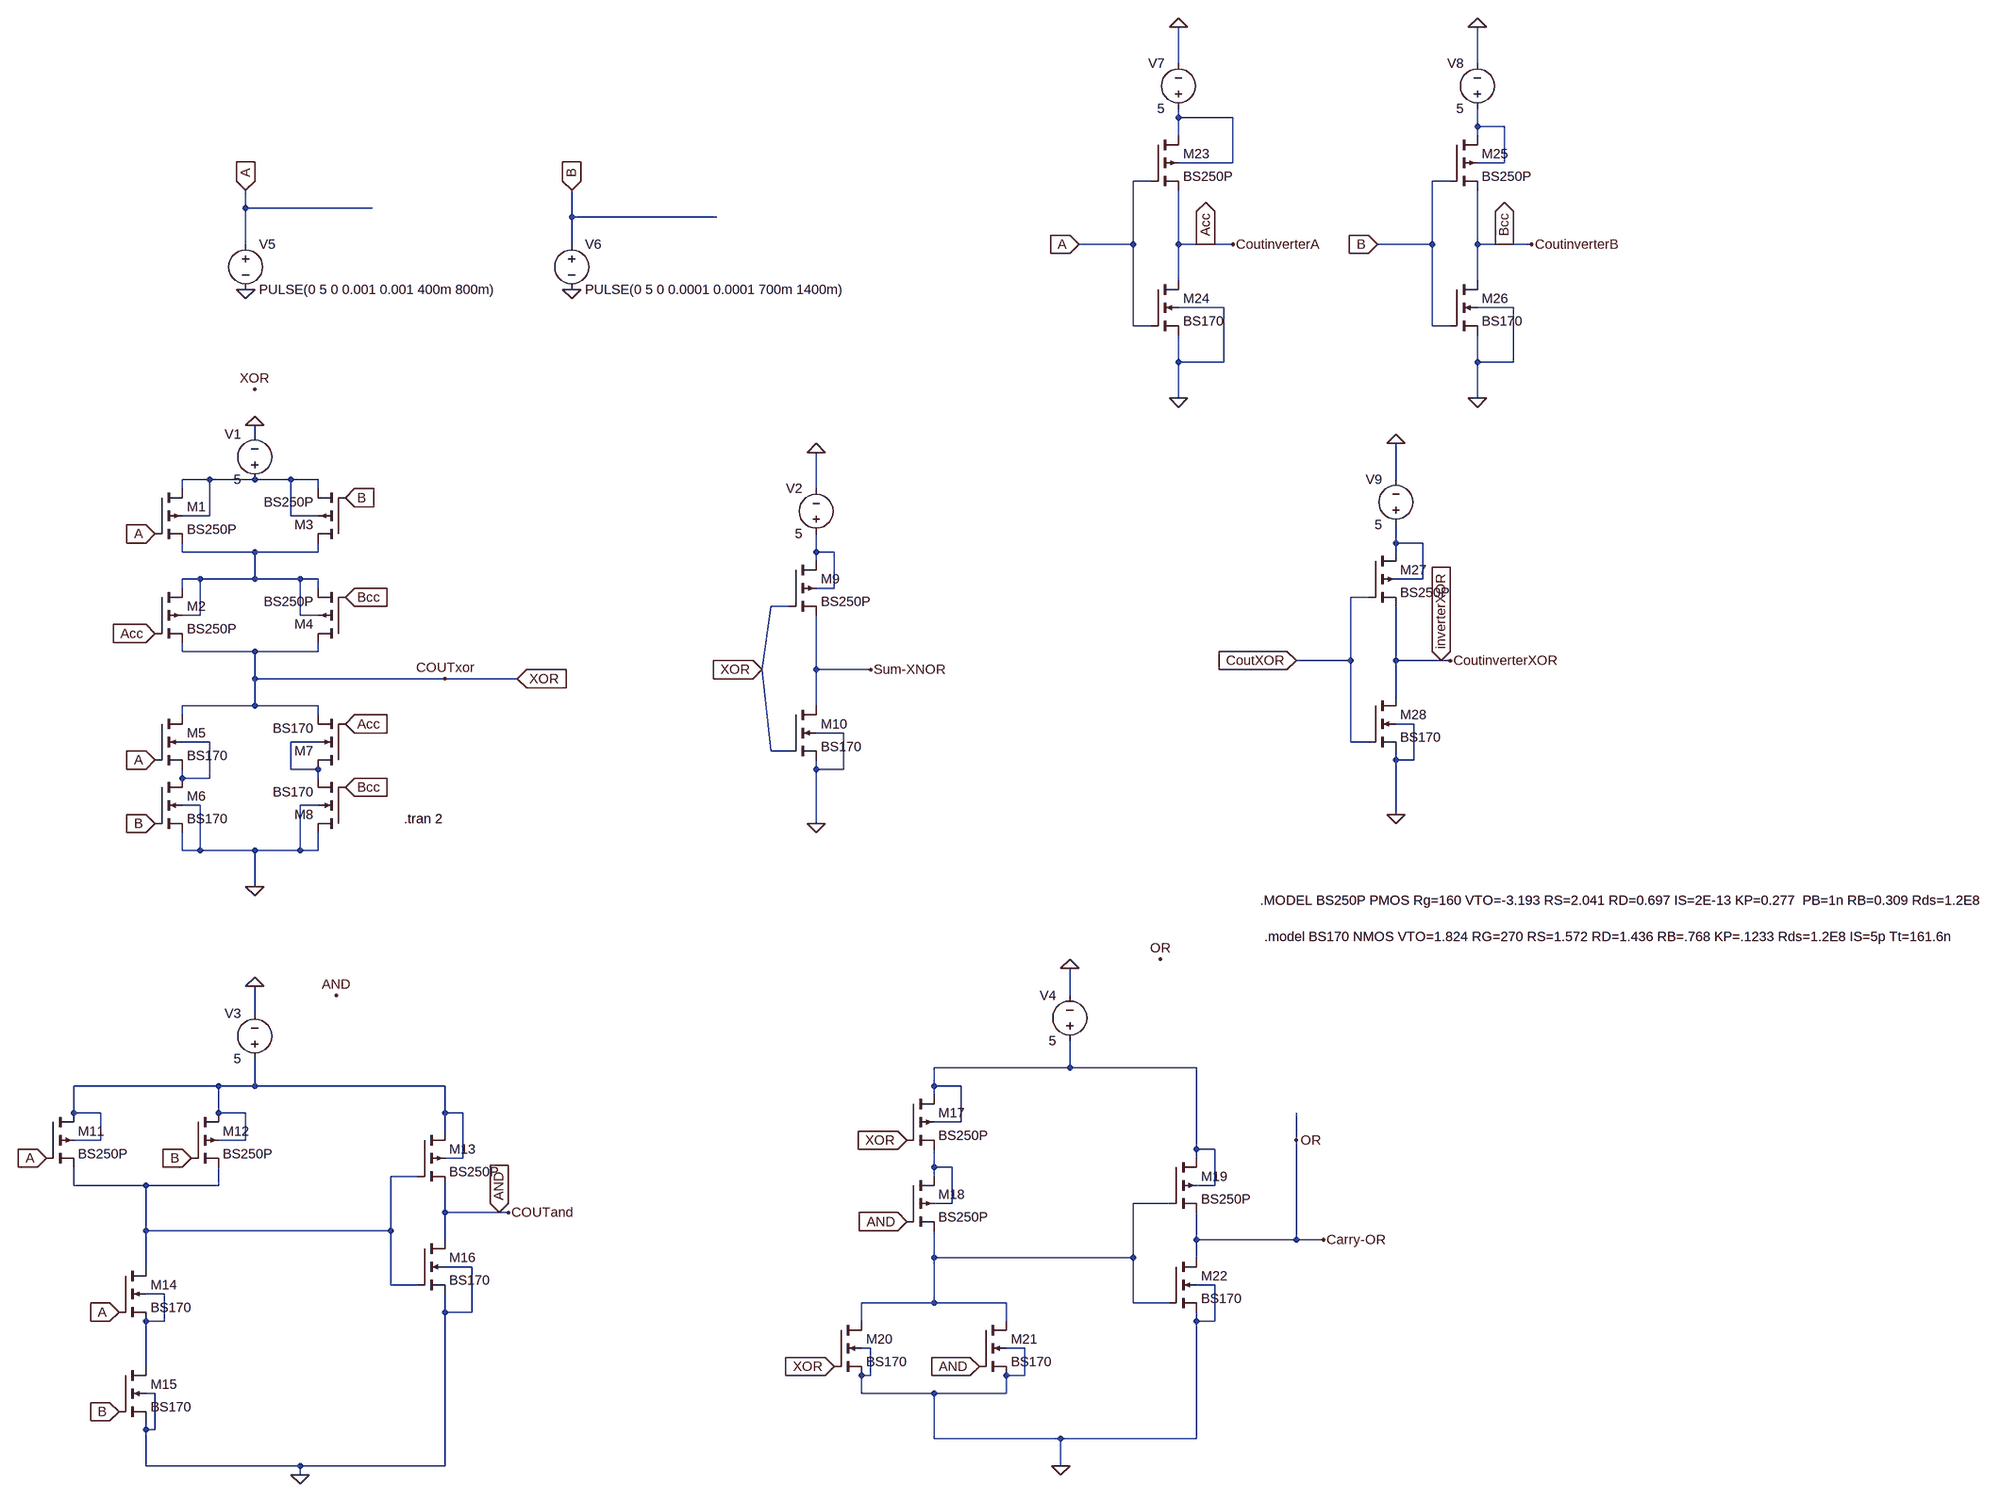
[diagram p0: schematic FULL_CIRCUIT_LAST.asc]
FULL_CIRCUIT_LAST.asc, the LTspice schematic file:
Version 4
SHEET 1 4512 1652
WIRE 1680 -864 1680 -928
WIRE 2208 -864 2208 -928
WIRE 1680 -768 1680 -784
WIRE 1776 -768 1680 -768
WIRE 2208 -752 2208 -784
WIRE 2256 -752 2208 -752
WIRE 1680 -736 1680 -768
WIRE 2208 -736 2208 -752
WIRE 1776 -688 1776 -768
WIRE 1776 -688 1680 -688
WIRE 2256 -688 2256 -752
WIRE 2256 -688 2208 -688
WIRE 1632 -656 1600 -656
WIRE 2160 -656 2128 -656
WIRE 32 -608 32 -640
WIRE 256 -608 32 -608
WIRE 608 -592 608 -640
WIRE 864 -592 608 -592
WIRE 32 -544 32 -608
WIRE 608 -544 608 -592
WIRE 1600 -544 1600 -656
WIRE 1600 -544 1504 -544
WIRE 1680 -544 1680 -640
WIRE 1728 -544 1680 -544
WIRE 1776 -544 1728 -544
WIRE 2128 -544 2128 -656
WIRE 2128 -544 2032 -544
WIRE 2208 -544 2208 -640
WIRE 2256 -544 2208 -544
WIRE 2304 -544 2256 -544
WIRE 1680 -480 1680 -544
WIRE 2208 -480 2208 -544
WIRE 1760 -432 1680 -432
WIRE 2272 -432 2208 -432
WIRE 1600 -400 1600 -544
WIRE 1632 -400 1600 -400
WIRE 2128 -400 2128 -544
WIRE 2160 -400 2128 -400
WIRE 1680 -336 1680 -384
WIRE 1760 -336 1760 -432
WIRE 1760 -336 1680 -336
WIRE 2208 -336 2208 -384
WIRE 2272 -336 2272 -432
WIRE 2272 -336 2208 -336
WIRE 1680 -272 1680 -336
WIRE 2208 -272 2208 -336
WIRE 48 -208 48 -224
WIRE -32 -128 -80 -128
WIRE 48 -128 -32 -128
WIRE 112 -128 48 -128
WIRE 160 -128 112 -128
WIRE 2064 -128 2064 -192
WIRE -80 -112 -80 -128
WIRE 160 -112 160 -128
WIRE 1040 -112 1040 -176
WIRE -32 -64 -32 -128
WIRE -32 -64 -80 -64
WIRE 112 -64 112 -128
WIRE 160 -64 112 -64
WIRE 2064 -16 2064 -48
WIRE 2112 -16 2064 -16
WIRE -80 0 -80 -16
WIRE 48 0 -80 0
WIRE 160 0 160 -16
WIRE 160 0 48 0
WIRE 1040 0 1040 -32
WIRE 1072 0 1040 0
WIRE 2064 0 2064 -16
WIRE 1040 16 1040 0
WIRE -48 48 -80 48
WIRE 48 48 48 0
WIRE 48 48 -48 48
WIRE 128 48 48 48
WIRE 160 48 128 48
WIRE 2112 48 2112 -16
WIRE 2112 48 2064 48
WIRE -80 64 -80 48
WIRE 160 64 160 48
WIRE 1072 64 1072 0
WIRE 1072 64 1040 64
WIRE 2016 80 1984 80
WIRE 992 96 960 96
WIRE -48 112 -48 48
WIRE -48 112 -80 112
WIRE 128 112 128 48
WIRE 160 112 128 112
WIRE -80 176 -80 160
WIRE 48 176 -80 176
WIRE 160 176 160 160
WIRE 160 176 48 176
WIRE 1984 192 1984 80
WIRE 1984 192 1888 192
WIRE 2064 192 2064 96
WIRE 2144 192 2064 192
WIRE 2160 192 2144 192
WIRE 944 208 960 96
WIRE 1040 208 1040 112
WIRE 1136 208 1040 208
WIRE 48 224 48 176
WIRE 384 224 48 224
WIRE 512 224 384 224
WIRE 2064 256 2064 192
WIRE 48 272 48 224
WIRE 48 272 -80 272
WIRE 160 272 48 272
WIRE 1040 272 1040 208
WIRE -80 288 -80 272
WIRE 160 288 160 272
WIRE 2096 304 2064 304
WIRE 1088 320 1040 320
WIRE -32 336 -80 336
WIRE 160 336 112 336
WIRE 1984 336 1984 192
WIRE 2016 336 1984 336
WIRE 960 352 944 208
WIRE 992 352 960 352
WIRE 2064 368 2064 352
WIRE 2096 368 2096 304
WIRE 2096 368 2064 368
WIRE 112 384 112 336
WIRE 160 384 112 384
WIRE 1040 384 1040 368
WIRE 1088 384 1088 320
WIRE 1088 384 1040 384
WIRE -80 400 -80 384
WIRE -32 400 -32 336
WIRE -32 400 -80 400
WIRE 160 400 160 384
WIRE -48 448 -80 448
WIRE 160 448 128 448
WIRE 2064 464 2064 368
WIRE 1040 480 1040 384
WIRE -80 528 -80 496
WIRE -48 528 -48 448
WIRE -48 528 -80 528
WIRE 48 528 -48 528
WIRE 128 528 128 448
WIRE 128 528 48 528
WIRE 160 528 160 496
WIRE 160 528 128 528
WIRE 48 592 48 528
WIRE 1488 784 1488 736
WIRE 48 816 48 768
WIRE 1488 912 1488 864
WIRE 1488 912 1248 912
WIRE 1712 912 1488 912
WIRE -16 944 -272 944
WIRE 48 944 48 896
WIRE 48 944 -16 944
WIRE 384 944 48 944
WIRE 1248 944 1248 912
WIRE 1296 944 1248 944
WIRE 1248 960 1248 944
WIRE -272 992 -272 944
WIRE -224 992 -272 992
WIRE -16 992 -16 944
WIRE 32 992 -16 992
WIRE 384 992 384 944
WIRE 416 992 384 992
WIRE 1296 1008 1296 944
WIRE 1296 1008 1248 1008
WIRE 384 1024 384 992
WIRE -224 1040 -224 992
WIRE -224 1040 -272 1040
WIRE 32 1040 32 992
WIRE 32 1040 -16 1040
WIRE 1888 1040 1888 992
WIRE 1712 1056 1712 912
WIRE 1744 1056 1712 1056
WIRE 416 1072 416 992
WIRE 416 1072 384 1072
WIRE 1712 1072 1712 1056
WIRE 1248 1088 1248 1056
WIRE 1280 1088 1248 1088
WIRE 336 1104 288 1104
WIRE 1248 1104 1248 1088
WIRE -272 1120 -272 1088
WIRE -144 1120 -272 1120
WIRE -16 1120 -16 1088
WIRE -16 1120 -144 1120
WIRE 1744 1120 1744 1056
WIRE 1744 1120 1712 1120
WIRE 1280 1152 1280 1088
WIRE 1280 1152 1248 1152
WIRE 1664 1152 1600 1152
WIRE 384 1168 384 1120
WIRE 480 1168 384 1168
WIRE 496 1168 480 1168
WIRE -144 1200 -144 1120
WIRE 288 1200 288 1104
WIRE 288 1200 -144 1200
WIRE 384 1216 384 1168
WIRE 1712 1216 1712 1168
WIRE 1888 1216 1888 1040
WIRE 1888 1216 1712 1216
WIRE 1936 1216 1888 1216
WIRE 1248 1248 1248 1200
WIRE 1600 1248 1600 1152
WIRE 1600 1248 1248 1248
WIRE 1712 1248 1712 1216
WIRE -144 1264 -144 1200
WIRE 432 1264 384 1264
WIRE 288 1296 288 1200
WIRE 336 1296 288 1296
WIRE 1744 1296 1712 1296
WIRE -112 1312 -144 1312
WIRE 1248 1328 1248 1248
WIRE 1248 1328 1120 1328
WIRE 1376 1328 1248 1328
WIRE 1600 1328 1600 1248
WIRE 1664 1328 1600 1328
WIRE 384 1344 384 1312
WIRE 432 1344 432 1264
WIRE 432 1344 384 1344
WIRE -112 1360 -112 1312
WIRE -112 1360 -144 1360
WIRE 1120 1360 1120 1328
WIRE 1376 1360 1376 1328
WIRE 1712 1360 1712 1344
WIRE 1744 1360 1744 1296
WIRE 1744 1360 1712 1360
WIRE 1136 1408 1120 1408
WIRE 1408 1408 1376 1408
WIRE -144 1440 -144 1360
WIRE 1136 1456 1136 1408
WIRE 1136 1456 1120 1456
WIRE 1408 1456 1408 1408
WIRE 1408 1456 1376 1456
WIRE -128 1488 -144 1488
WIRE 1120 1488 1120 1456
WIRE 1248 1488 1120 1488
WIRE 1376 1488 1376 1456
WIRE 1376 1488 1248 1488
WIRE -144 1552 -144 1536
WIRE -128 1552 -128 1488
WIRE -128 1552 -144 1552
WIRE 1248 1568 1248 1488
WIRE 1472 1568 1248 1568
WIRE 1712 1568 1712 1360
WIRE 1712 1568 1472 1568
WIRE -144 1616 -144 1552
WIRE 128 1616 -144 1616
WIRE 384 1616 384 1344
WIRE 384 1616 128 1616
WIRE 1472 1616 1472 1568
WIRE 128 1632 128 1616
FLAG 1040 -176 0
FLAG 1040 480 0
FLAG 128 1632 0
FLAG -320 1072 A
IOPIN -320 1072 In
FLAG -192 1344 A
IOPIN -192 1344 In
FLAG -64 1072 B
IOPIN -64 1072 In
FLAG -192 1520 B
IOPIN -192 1520 In
FLAG 48 768 0
FLAG 496 1168 COUTand
FLAG 192 784 AND
FLAG 1472 1616 0
FLAG 1488 736 0
FLAG 1936 1216 Carry-OR
FLAG 1648 720 OR
FLAG 1136 208 Sum-XNOR
FLAG 32 -640 A
IOPIN 32 -640 In
FLAG 608 -640 B
IOPIN 608 -640 In
FLAG 32 -464 0
FLAG 608 -464 0
FLAG 1680 -928 0
FLAG 1680 -272 0
FLAG 1504 -544 A
IOPIN 1504 -544 In
FLAG 1776 -544 CoutinverterA
FLAG 2208 -928 0
FLAG 2208 -272 0
FLAG 2032 -544 B
IOPIN 2032 -544 In
FLAG 2304 -544 CoutinverterB
FLAG 1728 -544 Acc
IOPIN 1728 -544 Out
FLAG 2256 -544 Bcc
IOPIN 2256 -544 Out
FLAG -128 -32 A
IOPIN -128 -32 In
FLAG -128 368 A
IOPIN -128 368 In
FLAG 208 -96 B
IOPIN 208 -96 In
FLAG -128 480 B
IOPIN -128 480 In
FLAG -128 144 Acc
IOPIN -128 144 In
FLAG 208 304 Acc
IOPIN 208 304 In
FLAG 208 80 Bcc
IOPIN 208 80 In
FLAG 208 416 Bcc
IOPIN 208 416 In
FLAG 48 -224 0
FLAG 384 224 COUTxor
FLAG 48 -288 XOR
FLAG 48 592 0
FLAG 2064 -192 0
FLAG 2064 464 0
FLAG 2160 192 CoutinverterXOR
FLAG 512 224 XOR
IOPIN 512 224 In
FLAG 1888 192 CoutXOR
IOPIN 1888 192 In
FLAG 2144 192 inverterXOR
IOPIN 2144 192 In
FLAG 1200 1040 XOR
IOPIN 1200 1040 In
FLAG 1072 1440 XOR
IOPIN 1072 1440 In
FLAG 480 1168 AND
IOPIN 480 1168 In
FLAG 1200 1184 AND
IOPIN 1200 1184 In
FLAG 1328 1440 AND
IOPIN 1328 1440 In
FLAG 944 208 XOR
IOPIN 944 208 In
FLAG 1888 1040 OR
SYMBOL pmos4 992 16 R0
SYMATTR InstName M9
SYMATTR Value BS250P
SYMBOL nmos4 992 272 R0
SYMATTR InstName M10
SYMATTR Value BS170
SYMBOL voltage 1040 -16 R180
WINDOW 0 24 96 Left 2
WINDOW 3 24 16 Left 2
WINDOW 123 0 0 Left 2
WINDOW 39 0 0 Left 2
SYMATTR InstName V2
SYMATTR Value 5
SYMBOL pmos4 -320 992 R0
SYMATTR InstName M11
SYMATTR Value BS250P
SYMBOL pmos4 -64 992 R0
SYMATTR InstName M12
SYMATTR Value BS250P
SYMBOL pmos4 336 1024 R0
SYMATTR InstName M13
SYMATTR Value BS250P
SYMBOL voltage 48 912 R180
WINDOW 0 24 96 Left 2
WINDOW 3 24 16 Left 2
WINDOW 123 0 0 Left 2
WINDOW 39 0 0 Left 2
SYMATTR InstName V3
SYMATTR Value 5
SYMBOL voltage 1488 880 R180
WINDOW 0 24 96 Left 2
WINDOW 3 24 16 Left 2
WINDOW 123 0 0 Left 2
WINDOW 39 0 0 Left 2
SYMATTR InstName V4
SYMATTR Value 5
SYMBOL voltage 32 -560 R0
WINDOW 123 0 0 Left 2
WINDOW 39 0 0 Left 2
SYMATTR InstName V5
SYMATTR Value PULSE(0 5 0 0.001 0.001 400m 800m)
SYMBOL voltage 608 -560 R0
WINDOW 123 0 0 Left 2
WINDOW 39 0 0 Left 2
SYMATTR InstName V6
SYMATTR Value PULSE(0 5 0 0.0001 0.0001 700m 1400m)
SYMBOL pmos4 1632 -736 R0
SYMATTR InstName M23
SYMATTR Value BS250P
SYMBOL nmos4 1632 -480 R0
SYMATTR InstName M24
SYMATTR Value BS170
SYMBOL voltage 1680 -768 R180
WINDOW 0 24 96 Left 2
WINDOW 3 24 16 Left 2
WINDOW 123 0 0 Left 2
WINDOW 39 0 0 Left 2
SYMATTR InstName V7
SYMATTR Value 5
SYMBOL pmos4 2160 -736 R0
SYMATTR InstName M25
SYMATTR Value BS250P
SYMBOL nmos4 2160 -480 R0
SYMATTR InstName M26
SYMATTR Value BS170
SYMBOL voltage 2208 -768 R180
WINDOW 0 24 96 Left 2
WINDOW 3 24 16 Left 2
WINDOW 123 0 0 Left 2
WINDOW 39 0 0 Left 2
SYMATTR InstName V8
SYMATTR Value 5
SYMBOL pmos4 1200 960 R0
SYMATTR InstName M17
SYMATTR Value BS250P
SYMBOL pmos4 1200 1104 R0
SYMATTR InstName M18
SYMATTR Value BS250P
SYMBOL pmos4 1664 1072 R0
SYMATTR InstName M19
SYMATTR Value BS250P
SYMBOL nmos4 1072 1360 R0
SYMATTR InstName M20
SYMATTR Value BS170
SYMBOL nmos4 1328 1360 R0
SYMATTR InstName M21
SYMATTR Value BS170
SYMBOL nmos4 1664 1248 R0
SYMATTR InstName M22
SYMATTR Value BS170
SYMBOL voltage 48 -112 R180
WINDOW 0 24 96 Left 2
WINDOW 3 24 16 Left 2
WINDOW 123 0 0 Left 2
WINDOW 39 0 0 Left 2
SYMATTR InstName V1
SYMATTR Value 5
SYMBOL pmos4 -128 -112 R0
SYMATTR InstName M1
SYMATTR Value BS250P
SYMBOL pmos4 -128 64 R0
SYMATTR InstName M2
SYMATTR Value BS250P
SYMBOL pmos4 208 -16 R180
SYMATTR InstName M3
SYMATTR Value BS250P
SYMBOL pmos4 208 160 R180
SYMATTR InstName M4
SYMATTR Value BS250P
SYMBOL nmos4 -128 288 R0
SYMATTR InstName M5
SYMATTR Value BS170
SYMBOL nmos4 -128 400 R0
SYMATTR InstName M6
SYMATTR Value BS170
SYMBOL nmos4 208 384 R180
SYMATTR InstName M7
SYMATTR Value BS170
SYMBOL nmos4 208 496 R180
SYMATTR InstName M8
SYMATTR Value BS170
SYMBOL pmos4 2016 0 R0
SYMATTR InstName M27
SYMATTR Value BS250P
SYMBOL nmos4 2016 256 R0
SYMATTR InstName M28
SYMATTR Value BS170
SYMBOL voltage 2064 -32 R180
WINDOW 0 24 96 Left 2
WINDOW 3 24 16 Left 2
WINDOW 123 0 0 Left 2
WINDOW 39 0 0 Left 2
SYMATTR InstName V9
SYMATTR Value 5
SYMBOL nmos4 -192 1264 R0
SYMATTR InstName M14
SYMATTR Value BS170
SYMBOL nmos4 -192 1440 R0
SYMATTR InstName M15
SYMATTR Value BS170
SYMBOL nmos4 336 1216 R0
SYMATTR InstName M16
SYMATTR Value BS170
TEXT 312 472 Left 2 !.tran 2
TEXT 1824 616 Left 2 !.MODEL BS250P PMOS Rg=160 VTO=-3.193 RS=2.041 RD=0.697 IS=2E-13 KP=0.277  PB=1n RB=0.309 Rds=1.2E8
TEXT 1832 680 Left 2 !.model BS170 NMOS VTO=1.824 RG=270 RS=1.572 RD=1.436 RB=.768 KP=.1233 Rds=1.2E8 IS=5p Tt=161.6n

The netlist it stands for:
* FULL_CIRCUIT_LAST.asc
M9 N006 XOR Sum-XNOR N006 BS250P
M10 Sum-XNOR XOR 0 0 BS170
V2 N006 0 5
M11 N010 A N012 N010 BS250P
M12 N010 B N012 N010 BS250P
M13 N010 N012 AND N010 BS250P
V3 N010 0 5
V4 N009 0 5
V5 A 0 PULSE(0 5 0 0.001 0.001 400m 800m)
V6 B 0 PULSE(0 5 0 0.0001 0.0001 700m 1400m)
M23 N001 A Acc N001 BS250P
M24 Acc A 0 0 BS170
V7 N001 0 5
M25 N002 B Bcc N002 BS250P
M26 Bcc B 0 0 BS170
V8 N002 0 5
M17 N009 XOR N011 N009 BS250P
M18 N011 AND N013 N011 BS250P
M19 N009 N013 OR N009 BS250P
M20 N013 XOR 0 0 BS170
M21 N013 AND 0 0 BS170
M22 OR N013 0 0 BS170
V1 N003 0 5
M1 N003 A N005 N003 BS250P
M2 N005 Acc XOR N005 BS250P
M3 N005 B N003 N003 BS250P
M4 XOR Bcc N005 N005 BS250P
M5 XOR A N007 N007 BS170
M6 N007 B 0 0 BS170
M7 N008 Acc XOR N008 BS170
M8 0 Bcc N008 0 BS170
M27 N004 XOR inverterXOR N004 BS250P
M28 inverterXOR XOR 0 0 BS170
V9 N004 0 5
M14 N012 A N014 N014 BS170
M15 N014 B 0 0 BS170
M16 AND N012 0 0 BS170
.model NMOS NMOS
.model PMOS PMOS
.lib standard.mos
.tran 2
.MODEL BS250P PMOS Rg=160 VTO=-3.193 RS=2.041 RD=0.697 IS=2E-13 KP=0.277  PB=1n RB=0.309 Rds=1.2E8
.model BS170 NMOS VTO=1.824 RG=270 RS=1.572 RD=1.436 RB=.768 KP=.1233 Rds=1.2E8 IS=5p Tt=161.6n
.backanno
.end